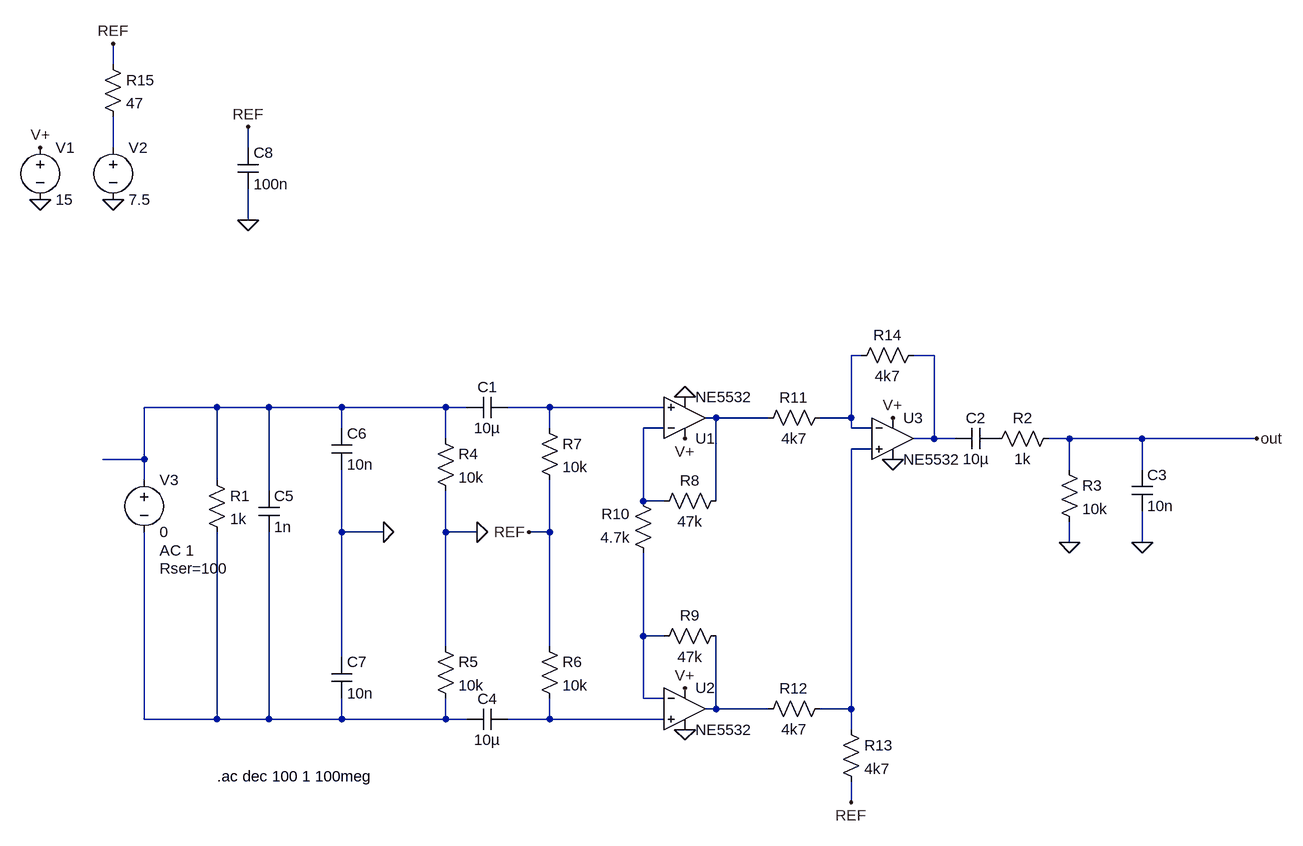
[diagram p0: schematic Input_mic_amplifier.asc]
Input_mic_amplifier.asc, the LTspice schematic file:
Version 4
SHEET 1 1064 824
WIRE -752 -400 -752 -432
WIRE -752 -272 -752 -320
WIRE -544 -272 -544 -304
WIRE -544 -160 -544 -208
WIRE 400 48 384 48
WIRE 512 48 480 48
WIRE -592 128 -704 128
WIRE -512 128 -592 128
WIRE -400 128 -512 128
WIRE -240 128 -400 128
WIRE -208 128 -240 128
WIRE -80 128 -144 128
WIRE 96 128 -80 128
WIRE 176 144 160 144
WIRE 256 144 176 144
WIRE 384 144 384 48
WIRE 384 144 336 144
WIRE -400 160 -400 128
WIRE -80 160 -80 128
WIRE 96 160 64 160
WIRE 384 160 384 144
WIRE 416 160 384 160
WIRE -240 176 -240 128
WIRE 512 176 512 48
WIRE 512 176 480 176
WIRE 544 176 512 176
WIRE 720 176 688 176
WIRE 832 176 720 176
WIRE 1008 176 832 176
WIRE 416 192 384 192
WIRE -704 208 -704 128
WIRE -704 208 -768 208
WIRE 720 224 720 176
WIRE 832 224 832 176
WIRE -704 240 -704 208
WIRE -592 240 -592 128
WIRE -512 256 -512 128
WIRE 64 272 64 160
WIRE 96 272 64 272
WIRE 176 272 176 144
WIRE -400 320 -400 224
WIRE -336 320 -400 320
WIRE -240 320 -240 256
WIRE -192 320 -240 320
WIRE -80 320 -80 240
WIRE -80 320 -112 320
WIRE 720 336 720 304
WIRE 832 336 832 288
WIRE 64 480 64 352
WIRE 96 480 64 480
WIRE -240 496 -240 320
WIRE -80 496 -80 320
WIRE -400 512 -400 320
WIRE 64 576 64 480
WIRE 96 576 64 576
WIRE 176 592 176 480
WIRE 176 592 160 592
WIRE 256 592 176 592
WIRE 384 592 384 192
WIRE 384 592 336 592
WIRE -704 608 -704 320
WIRE -592 608 -592 320
WIRE -592 608 -704 608
WIRE -512 608 -512 320
WIRE -512 608 -592 608
WIRE -400 608 -400 576
WIRE -400 608 -512 608
WIRE -240 608 -240 576
WIRE -240 608 -400 608
WIRE -208 608 -240 608
WIRE -80 608 -80 576
WIRE -80 608 -144 608
WIRE 96 608 -80 608
WIRE 384 624 384 592
WIRE 384 736 384 704
FLAG -864 -192 0
FLAG -752 -192 0
FLAG -864 -272 V+
FLAG 128 176 V+
FLAG -752 -432 REF
FLAG 720 336 0
FLAG 1008 176 out
FLAG 832 336 0
FLAG -192 320 0
FLAG 128 560 V+
FLAG 448 144 V+
FLAG -336 320 0
FLAG -544 -160 0
FLAG 128 624 0
FLAG 128 112 0
FLAG 448 208 0
FLAG -112 320 REF
FLAG -544 -304 REF
FLAG 384 736 REF
DATAFLAG -32 128 ""
DATAFLAG -48 608 ""
DATAFLAG 384 304 ""
DATAFLAG 512 48 ""
DATAFLAG 64 448 ""
DATAFLAG 384 80 ""
SYMBOL Opamps\\NE5532 128 208 M180
SYMATTR InstName U1
SYMBOL voltage -864 -288 R0
WINDOW 123 0 0 Left 0
WINDOW 39 0 0 Left 0
SYMATTR InstName V1
SYMATTR Value 15
SYMBOL voltage -752 -288 R0
WINDOW 123 0 0 Left 0
WINDOW 39 0 0 Left 0
SYMATTR InstName V2
SYMATTR Value 7.5
SYMBOL cap -144 112 R90
WINDOW 0 0 32 VBottom 2
WINDOW 3 32 32 VTop 2
SYMATTR InstName C1
SYMATTR Value 10µ
SYMBOL voltage -704 224 R0
WINDOW 123 24 124 Left 2
WINDOW 39 24 152 Left 2
SYMATTR Value2 AC 1
SYMATTR SpiceLine Rser=100
SYMATTR InstName V3
SYMATTR Value 0
SYMBOL cap 608 160 R90
WINDOW 0 0 32 VBottom 2
WINDOW 3 32 32 VTop 2
SYMATTR InstName C2
SYMATTR Value 10µ
SYMBOL res 704 160 R90
WINDOW 0 0 56 VBottom 2
WINDOW 3 32 56 VTop 2
SYMATTR InstName R2
SYMATTR Value 1k
SYMBOL res 704 208 R0
SYMATTR InstName R3
SYMATTR Value 10k
SYMBOL cap 816 224 R0
SYMATTR InstName C3
SYMATTR Value 10n
SYMBOL cap -144 592 R90
WINDOW 0 0 32 VBottom 2
WINDOW 3 32 32 VTop 2
SYMATTR InstName C4
SYMATTR Value 10µ
SYMBOL res -608 224 R0
SYMATTR InstName R1
SYMATTR Value 1k
SYMBOL res -256 160 R0
SYMATTR InstName R4
SYMATTR Value 10k
SYMBOL res -256 480 R0
SYMATTR InstName R5
SYMATTR Value 10k
SYMBOL res -96 480 R0
SYMATTR InstName R6
SYMATTR Value 10k
SYMBOL res -96 144 R0
SYMATTR InstName R7
SYMATTR Value 10k
SYMBOL Opamps\\NE5532 128 528 R0
SYMATTR InstName U2
SYMBOL Opamps\\NE5532 448 112 R0
SYMATTR InstName U3
SYMBOL res 192 256 R90
WINDOW 0 0 56 VBottom 2
WINDOW 3 32 56 VTop 2
SYMATTR InstName R8
SYMATTR Value 47k
SYMBOL res 192 464 R90
WINDOW 0 0 56 VBottom 2
WINDOW 3 32 56 VTop 2
SYMATTR InstName R9
SYMATTR Value 47k
SYMBOL res 80 368 R180
WINDOW 0 36 76 Left 2
WINDOW 3 36 40 Left 2
SYMATTR InstName R10
SYMATTR Value 4.7k
SYMBOL res 352 128 R90
WINDOW 0 0 56 VBottom 2
WINDOW 3 32 56 VTop 2
SYMATTR InstName R11
SYMATTR Value 4k7
SYMBOL res 352 576 R90
WINDOW 0 0 56 VBottom 2
WINDOW 3 32 56 VTop 2
SYMATTR InstName R12
SYMATTR Value 4k7
SYMBOL res 368 608 R0
SYMATTR InstName R13
SYMATTR Value 4k7
SYMBOL res 496 32 R90
WINDOW 0 0 56 VBottom 2
WINDOW 3 32 56 VTop 2
SYMATTR InstName R14
SYMATTR Value 4k7
SYMBOL cap -528 256 R0
SYMATTR InstName C5
SYMATTR Value 1n
SYMBOL cap -416 160 R0
SYMATTR InstName C6
SYMATTR Value 10n
SYMBOL cap -416 512 R0
SYMATTR InstName C7
SYMATTR Value 10n
SYMBOL cap -560 -272 R0
SYMATTR InstName C8
SYMATTR Value 100n
SYMBOL res -768 -416 R0
SYMATTR InstName R15
SYMATTR Value 47
TEXT -592 696 Left 2 !.ac dec 100 1 100meg

The netlist it stands for:
* Input_mic_amplifier.asc
XU1 N005 N007 V+ 0 N006 NE5532  ; pins In+ In- V+ V- OUT
V1 V+ 0 15
V2 N001 0 7.5
C1 N005 N004 10µ
V3 N004 N011 0 AC 1 Rser=100
C2 P001 N003 10µ
R2 out P001 1k
R3 out 0 10k
C3 out 0 10n
C4 N012 N011 10µ
R1 N004 N011 1k
R4 N004 0 10k
R5 0 N011 10k
R6 REF N012 10k
R7 N005 REF 10k
XU2 N012 N009 V+ 0 N010 NE5532  ; pins In+ In- V+ V- OUT
XU3 N008 N002 V+ 0 N003 NE5532  ; pins In+ In- V+ V- OUT
R8 N006 N007 47k
R9 N010 N009 47k
R10 N009 N007 4.7k
R11 N002 N006 4k7
R12 N008 N010 4k7
R13 N008 REF 4k7
R14 N003 N002 4k7
C5 N004 N011 1n
C6 N004 0 10n
C7 0 N011 10n
C8 REF 0 100n
R15 REF N001 47
.ac dec 100 1 100meg
.backanno
.end